# EAGLE design master_jorge2 (EAGLE 7.1.0)
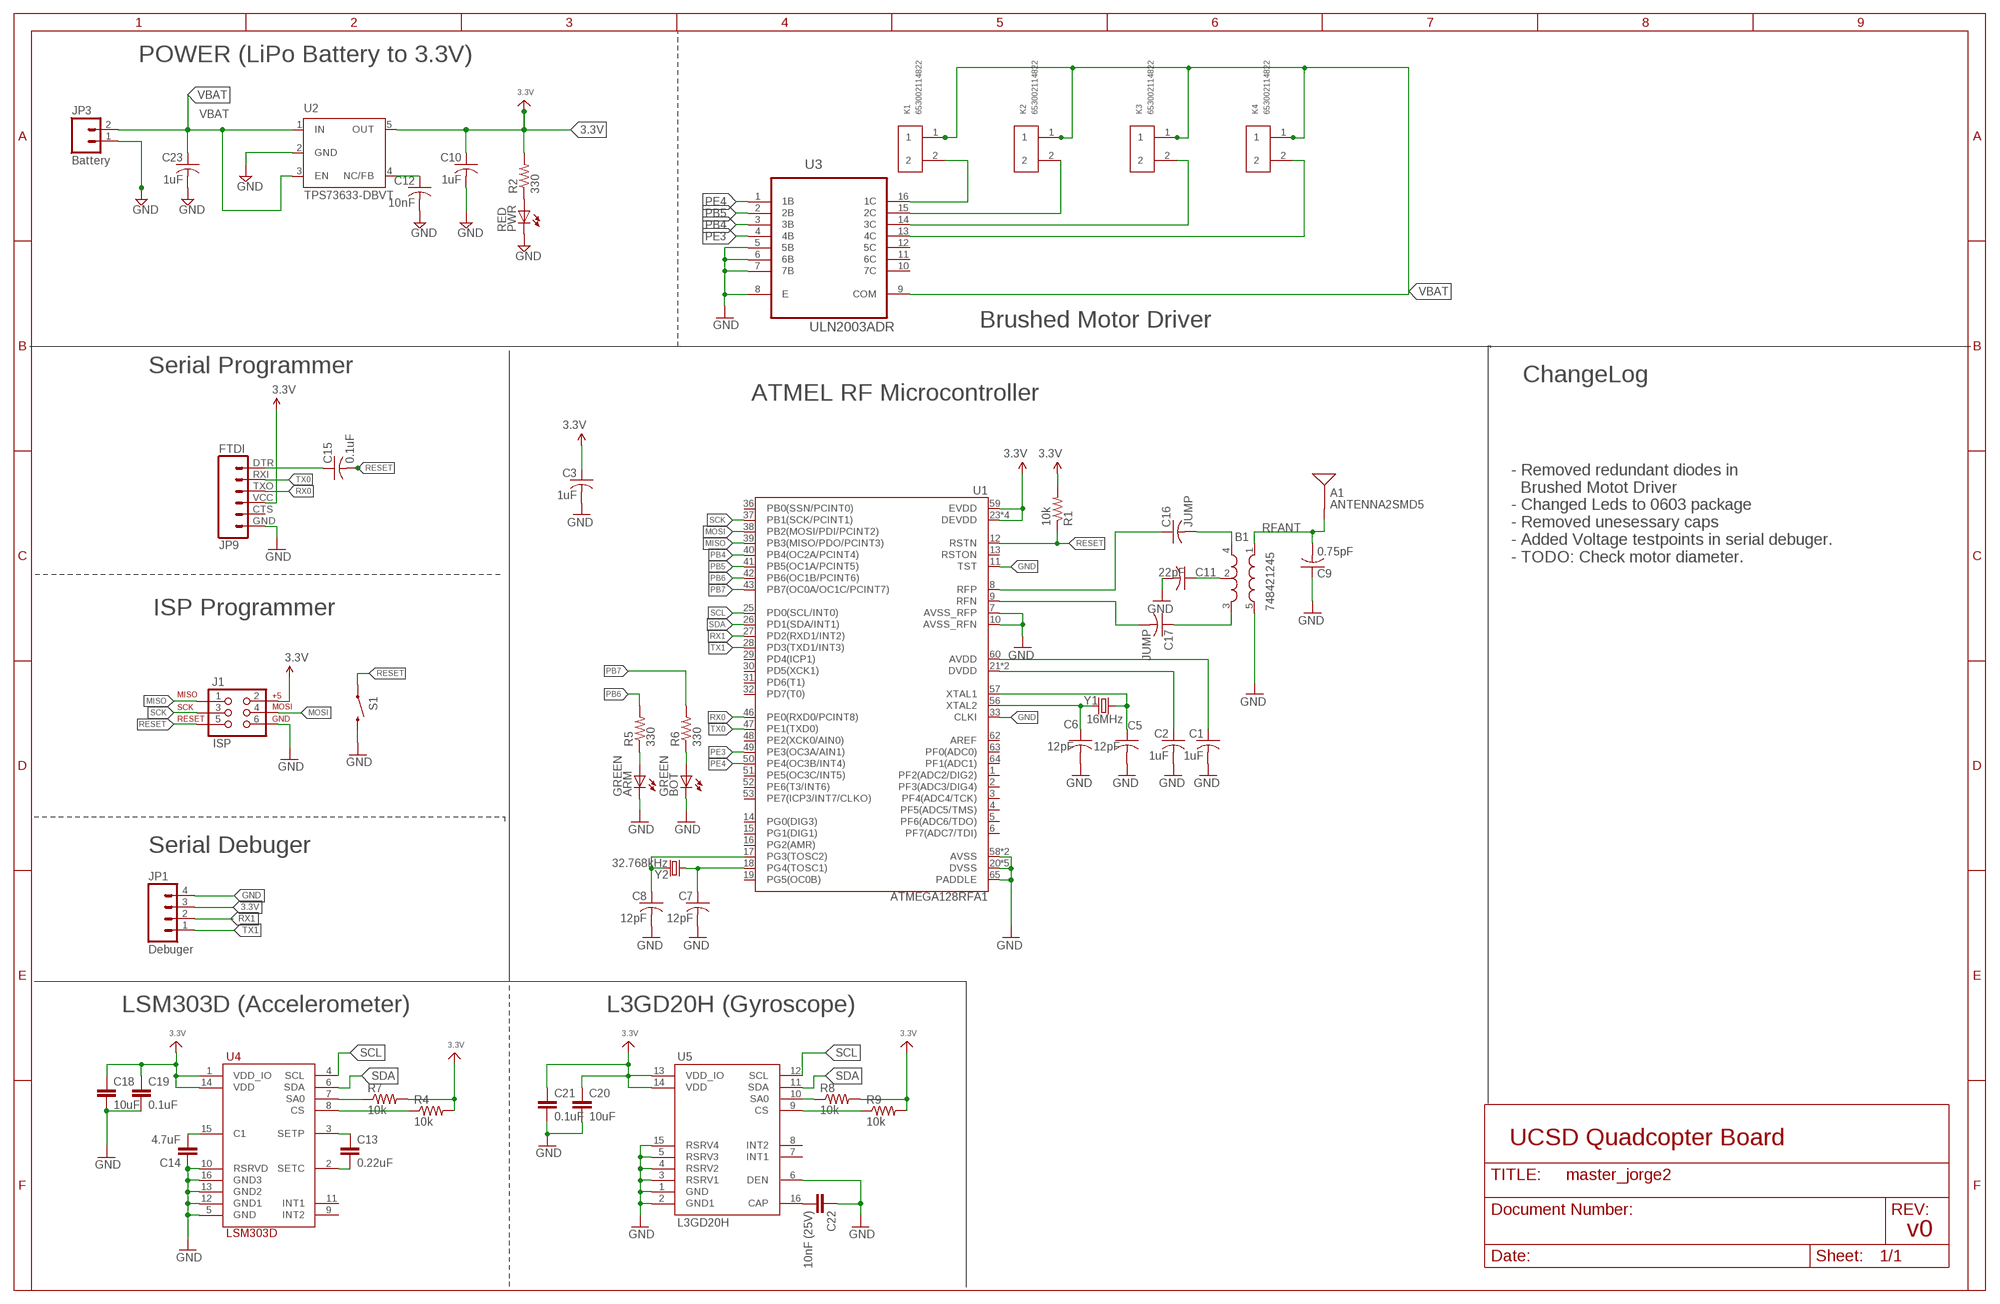
[diagram p0: schematic, sheet 1]

## Parts
A1  ANTENNA2SMD5  [ANTENNA-CHIP5]
ARM  GREEN  LEDCHIPLED_0603  [CHIPLED_0603]
B1  748421245  BALUN0805  [BALUN]
BOT  GREEN  LEDCHIPLED_0603  [CHIPLED_0603]
C1  1uF  C-USC0805  [C0805]
C2  1uF  C-USC0805  [C0805]
C3  1uF  C-USC0805  [C0805]
C5  12pF  C-USC0805  [C0805]
C6  12pF  C-USC0805  [C0805]
C7  12pF  C-USC0805  [C0805]
C8  12pF  C-USC0805  [C0805]
C9  0.75pF  C-USC0805  [C0805]
C10  1uF  C-USC0805  [C0805]
C11  22pF  C-USC0805  [C0805]
C12  10nF  C-USC0805  [C0805]
C13  0.22uF  CAP0805  [0805]
C14  4.7uF  CAP0805  [0805]
C15  0.1uF  C-USC0805  [C0805]
C16  JUMP  C-USC0805  [C0805]
C17  JUMP  C-USC0805  [C0805]
C18  10uF  CAP0805  [0805]
C19  0.1uF  CAP0805  [0805]
C20  10uF  CAP0805  [0805]
C21  0.1uF  CAP0805  [0805]
C22  10nF (25V)  CAP0805  [0805]
C23  1uF  C-USC0805  [C0805]
J1  ISP  AVR_SPI_PRG_6NS  [2X3-NS]
JP1  Debuger  M04PTH  [1X04]
JP3  Battery  M02PTH  [1X02]
JP9  FTDI  FTDI_BASICPTH  [FTDI_BASIC]
K1  653002114822  [653002114822]
K2  653002114822  [653002114822]
K3  653002114822  [653002114822]
K4  653002114822  [653002114822]
PWR  RED  LEDCHIPLED_0603  [CHIPLED_0603]
R1  10k  R-US_R0805  [R0805]
R2  330  R-US_R0805  [R0805]
R4  10k  RESISTOR0805-RES  [0805]
R5  330  R-US_R0805  [R0805]
R6  330  R-US_R0805  [R0805]
R7  10k  RESISTOR0805-RES  [0805]
R8  10k  RESISTOR0805-RES  [0805]
R9  10k  RESISTOR0805-RES  [0805]
S1  SWITCH-MOMENTARY-2SMD  [TACTILE_SWITCH_SMD]
U1  ATMEGA128RFA1  [QFN-64]
U2  TPS73633-DBVT  [SOT23-DBV]
U3  ULN2003ADR  [SOIC127P600X175-16N]
U4  LSM303D  [LGA16_3X3MM]
U5  L3GD20H  [LGA16_3X3MM]
Y1  16MHz  CRYSTAL5X3  [CRYSTAL-SMD-5X3]
Y2  32.768kHz  CRYSTAL32-SMD  [CRYSTAL-32KHZ-SMD]

## Nets
3.3V: C3.1 C10.1 C18.1 C19.1 C20.1 C21.1 J1.2 JP1.3 JP9.VCC R1.2 R2.2 R4.2 R7.2 R8.2 R9.2 U1.23(DEVDD) U1.34(DEVDD) U1.44(DEVDD) U1.54(DEVDD) U1.59(EVDD) U2.5(OUT) U4.1(VDD_IO) U4.14(VDD) U5.13(VDD_IO) U5.14(VDD)
AVDD: C1.1 U1.60(AVDD)
DTR: C15.1 JP9.DTR
DVDD: C2.1 U1.21(DVDD) U1.22(DVDD)
GND: ARM.C B1.5(GND) BOT.C C1.2 C2.2 C3.2 C5.2 C6.2 C7.2 C8.2 C9.1 C10.2 C11.2 C12.2 C14.1 C18.2 C19.2 C20.2 C21.2 C22.1 C23.2 J1.6 JP1.4 JP3.1 JP9.GND PWR.C S1.3 U1.7(AVSS_RFP) U1.10(AVSS_RFN) U1.11(TST) U1.20(DVSS) U1.24(DVSS) U1.33(CLKI) U1.35(DVSS) U1.45(DVSS) U1.55(DVSS) U1.58(AVSS) U1.61(AVSS) U1.65(PADDLE) U2.2(GND) U3.5(5B) U3.6(6B) U3.7(7B) U3.8(E) U4.5(GND) U4.10(RSRVD) U4.12(GND1) U4.13(GND2) U4.16(GND3) U5.1(GND) U5.2(GND1) U5.3(RSRV1) U5.4(RSRV2) U5.5(RSRV3) U5.6(DEN) U5.15(RSRV4)
MISO: J1.1 U1.39(PB3(MISO/PDO/PCINT3))
MOSI: J1.4 U1.38(PB2(MOSI/PDI/PCINT2))
N$1: C12.1 U2.4(NC/FB)
N$2: PWR.A R2.1
N$3: C5.1 U1.57(XTAL1) Y1.3
N$4: C6.1 U1.56(XTAL2) Y1.1
N$5: C7.1 U1.18(PG4(TOSC1)) Y2.X1
N$6: C8.1 U1.17(PG3(TOSC2)) Y2.X2
N$7: B1.2(GND) C11.1
N$8: ARM.A R5.1
N$9: C13.1 U4.3(SETP)
N$10: B1.4(OUT1) C16.2
N$11: B1.3(OUT2) C17.1
N$12: C13.2 U4.2(SETC)
N$13: BOT.A R6.1
N$14: R4.1 U4.8(CS)
N$15: R7.1 U4.7(SA0)
N$16: C14.2 U4.15(C1)
N$17: R8.1 U5.10(SA0)
N$18: R9.1 U5.9(CS)
N$19: C22.2 U5.16(CAP)
N$29: K1.2 U3.16(1C)
N$30: K2.2 U3.15(2C)
N$31: K3.2 U3.14(3C)
N$32: K4.2 U3.13(4C)
PB4: U1.40(PB4(OC2A/PCINT4)) U3.3(3B)
PB5: U1.41(PB5(OC1A/PCINT5)) U3.2(2B)
PB6: R5.2 U1.42(PB6(OC1B/PCINT6))
PB7: R6.2 U1.43(PB7(OC0A/OC1C/PCINT7))
PE3: U1.49(PE3(OC3A/AIN1)) U3.4(4B)
PE4: U1.50(PE4(OC3B/INT4)) U3.1(1B)
RESET: C15.2 J1.5 R1.1 S1.1 U1.12(RSTN)
RFANT [RFSIG]: A1.FEED(SIGNAL) B1.1(IN) C9.2
RFN: C17.2 U1.9(RFN)
RFP: C16.1 U1.8(RFP)
RX0: JP9.TXO U1.46(PE0(RXD0/PCINT8))
RX1: JP1.2 U1.27(PD2(RXD1/INT2))
SCK: J1.3 U1.37(PB1(SCK/PCINT1))
SCL: U1.25(PD0(SCL/INT0)) U4.4(SCL) U5.12(SCL)
SDA: U1.26(PD1(SDA/INT1)) U4.6(SDA) U5.11(SDA)
TX0: JP9.RXI U1.47(PE1(TXD0))
TX1: JP1.1 U1.28(PD3(TXD1/INT3))
VBAT: C23.1 JP3.2 K1.1 K2.1 K3.1 K4.1 U2.1(IN) U2.3(EN) U3.9(COM)
Unconnected: JP9.CTS U1.1(PF2(ADC2/DIG2)) U1.2(PF3(ADC3/DIG4)) U1.3(PF4(ADC4/TCK)) U1.4(PF5(ADC5/TMS)) U1.5(PF6(ADC6/TDO)) U1.6(PF7(ADC7/TDI)) U1.13(RSTON) U1.14(PG0(DIG3)) U1.15(PG1(DIG1)) U1.16(PG2(AMR)) U1.19(PG5(OC0B)) U1.29(PD4(ICP1)) U1.30(PD5(XCK1)) U1.31(PD6(T1)) U1.32(PD7(T0)) U1.36(PB0(SSN/PCINT0)) U1.48(PE2(XCK0/AIN0)) U1.51(PE5(OC3C/INT5)) U1.52(PE6(T3/INT6)) U1.53(PE7(ICP3/INT7/CLKO)) U1.62(AREF) U1.63(PF0(ADC0)) U1.64(PF1(ADC1)) U3.10(7C) U3.11(6C) U3.12(5C) U4.9(INT2) U4.11(INT1) U5.7(INT1) U5.8(INT2)

## Notes on the sheet
- POWER (LiPo Battery to 3.3V)
- Brushed Motor Driver
- Serial Programmer
- ChangeLog
- ATMEL RF Microcontroller
- - Removed redundant diodes in 
    Brushed Motot Driver
  - Changed Leds to 0603 package
  - Removed unesessary caps
  - Added Voltage testpoints in serial debuger.
  - TODO: Check motor diameter.
- ISP Programmer
- Serial Debuger
- LSM303D (Accelerometer) | L3GD20H (Gyroscope)
- UCSD Quadcopter Board
- v0

## Library data of the parts
A1 = SparkFun-RF:ANTENNA2: Chip antenna Single endded antenna. Common with smaller chip antennas. CHIP4 package is the GPS Chip Antenna SKU: GPS-08418. CHIP5 package is 2.4GHz chip antenna SKU: WRL-00144.
ARM BOT PWR = led:LED: LED OSRAM: - CHIPLED LG R971, LG N971, LY N971, LG Q971, LY Q971, LO R971, LY R971 LH N974, LH R974 LS Q976, LO Q976, LY Q976 LO Q996 - Hyper CHIPLED LW Q18S LB Q993, LB Q99A, LB R99A - SideLED LS A670, LO A670, LY A670, LG A670, LP A670 LB A673, LV A673, LT A673, LW A673 LH A674 LY A675 LS A676, LA A676, LO A676, LY A676, LW A676 LS A679, LY A679, LG A679 - Hyper Micro SIDELED® LS Y876, LA Y876, LO Y876, LY Y876 LT Y87S - SmartLED LW L88C, LW L88S LB L89C, LB L89S, LG L890 LS L89K, LO L89K, LY L89K LS L896, LA L896, LO L896, LY L896 - TOPLED LS T670, LO T670, LY T670, LG T670, LP T670 LSG T670, LSP T670, LSY T670, LOP T670, LYG T670 LG T671, LOG T671, LSG T671 LB T673, LV T673, LT T673, LW T673 LH T674 LS T676, LA T676, LO T676, LY T676, LB T676, LH T676, LSB T676, LW T676 LB T67C, LV T67C, LT T67C, LS T67K, LO T67K, LY T67K, LW E67C LS E67B, LA E67B, LO E67B, LY E67B, LB E67C, LV E67C, LT E67C LW T67C LS T679, LY T679, LG T679 LS T770, LO T770, LY T770, LG T770, LP T770 LB T773, LV T773, LT T773, LW T773 LH T774 LS E675, LA E675, LY E675, LS T675 LS T776, LA T776, LO T776, LY T776, LB T776 LHGB T686 LT T68C, LB T68C - Hyper Mini TOPLED® LB M676 - Mini TOPLED Santana® LG M470 LS M47K, LO M47K, LY M47K Source: http://www.osram.convergy.de LUXEON: - LUMILED® LXK2-PW12-R00, LXK2-PW12-S00, LXK2-PW14-U00, LXK2-PW14-V00 LXK2-PM12-R00, LXK2-PM12-S00, LXK2-PM14-U00 LXK2-PE12-Q00, LXK2-PE12-R00, LXK2-PE12-S00, LXK2-PE14-T00, LXK2-PE14-U00 LXK2-PB12-K00, LXK2-PB12-L00, LXK2-PB12-M00, LXK2-PB14-N00, LXK2-PB14-P00, LXK2-PB14-Q00 LXK2-PR12-L00, LXK2-PR12-M00, LXK2-PR14-Q00, LXK2-PR14-R00 LXK2-PD12-Q00, LXK2-PD12-R00, LXK2-PD12-S00 LXK2-PH12-R00, LXK2-PH12-S00 LXK2-PL12-P00, LXK2-PL12-Q00, LXK2-PL12-R00 Source: www.luxeon.com KINGBRIGHT: KA-3528ASYC Source: www.kingbright.com
B1 = SparkFun-RF:BALUN: 0805 footprint balun- Ember 351/357
C1-C3 C5-C12 C15-C17 C23 = resistor:C-US: CAPACITOR, American symbol
C13 C14 C18-C22 = SparkFun-Capacitors:CAP: Capacitor Standard 0603 ceramic capacitor, and 0.1" leaded capacitor.
J1 = SparkFun-Connectors:AVR_SPI_PRG_6: AVR ISP 6 Pin This is the reduced ISP connector for AVR programming. Common on Arduino. This footprint will take up less PCB space and can be used with a 10-pin to 6-pin adapter such as SKU: BOB-08508
JP1 = SparkFun-Connectors:M04: Header 4 Standard 4-pin 0.1" header. Use with straight break away headers (SKU : PRT-00116), right angle break away headers (PRT-00553), swiss pins (PRT-00743), machine pins (PRT-00117), and female headers (PRT-00115). Molex polarized connector foot print use with SKU : PRT-08231 with associated crimp pins and housings. 1MM SMD Version SKU: PRT-10208
JP3 = SparkFun:M02: Header 2 Standard 2-pin 0.1" header. Use with straight break away headers (SKU : PRT-00116), right angle break away headers (PRT-00553), swiss pins (PRT-00743), machine pins (PRT-00117), and female headers (PRT-00115). Molex polarized connector foot print use with SKU : PRT-08233 with associated crimp pins and housings.
JP9 = SparkFun-Connectors:FTDI_BASIC: FTDI Basic header with labels
K1-K4 = Wuerth_Elektronik_eiCan_Wire_to_Board_Connectors:653002114822: WR-WTB 1.25mm Male Vertical Shrouded Header, 2 Pins=>Code : Con_WTB_1.25_PCB_THT_653002114822 <http://katalog.we-online.de/media/thumbs2/eican/thb_Con_WTB_1.25_PCB_THT_6530xx114822_pf2.jpg> Details see: http://katalog.we-online.de/en/em/653_0xx_114_822 Created 2014-06-06, Karrer Zheng 2014 (C) Würth Elektronik; OC_FARNELL: unknown
R1 R2 R5 R6 = resistor:R-US_: RESISTOR, American symbol
R4 R7-R9 = SparkFun-Passives:RESISTOR: Resistor Basic schematic elements and footprints for 0603, 1206, and PTH resistors.
S1 = SparkFun-Electromechanical:SWITCH-MOMENTARY-2: Various NO switches- pushbuttons, reed, etc
U1 = SparkFun-DigitalIC:ATMEGA128RFA1: ATmega128RFA1 8-bit AVR Microcontroller with Low Power 2.4GHz Transceiver for ZigBee and IEEE 802.15.4
U2 = Power:TPS73633-DBVT
U3 = Texas Instruments_By_element14_Batch_1:ULN2003ADR: 8-BIT SHIFT REGISTERS WITH 3-STATE OUTPUT REGISTERS; MPN: ULN2003ADR; OC_FARNELL: 1470513; OC_NEWARK: 77C3560; PACKAGE: SOIC-16; SUPPLIER: TEXAS INSTRUMENTS
U4 = IMU_parts:LSM303D
U5 = IMU_parts:L3GD20H
Y1 Y2 = SparkFun-FreqCtrl:CRYSTAL: Various standard crystals. Proven footprints. Spark Fun Electronics SKU : COM-00534

## Net classes
1 RFSIG: width 0.457 mm, clearance 0.205 mm to class 0, clearance 0.205 mm

## Board
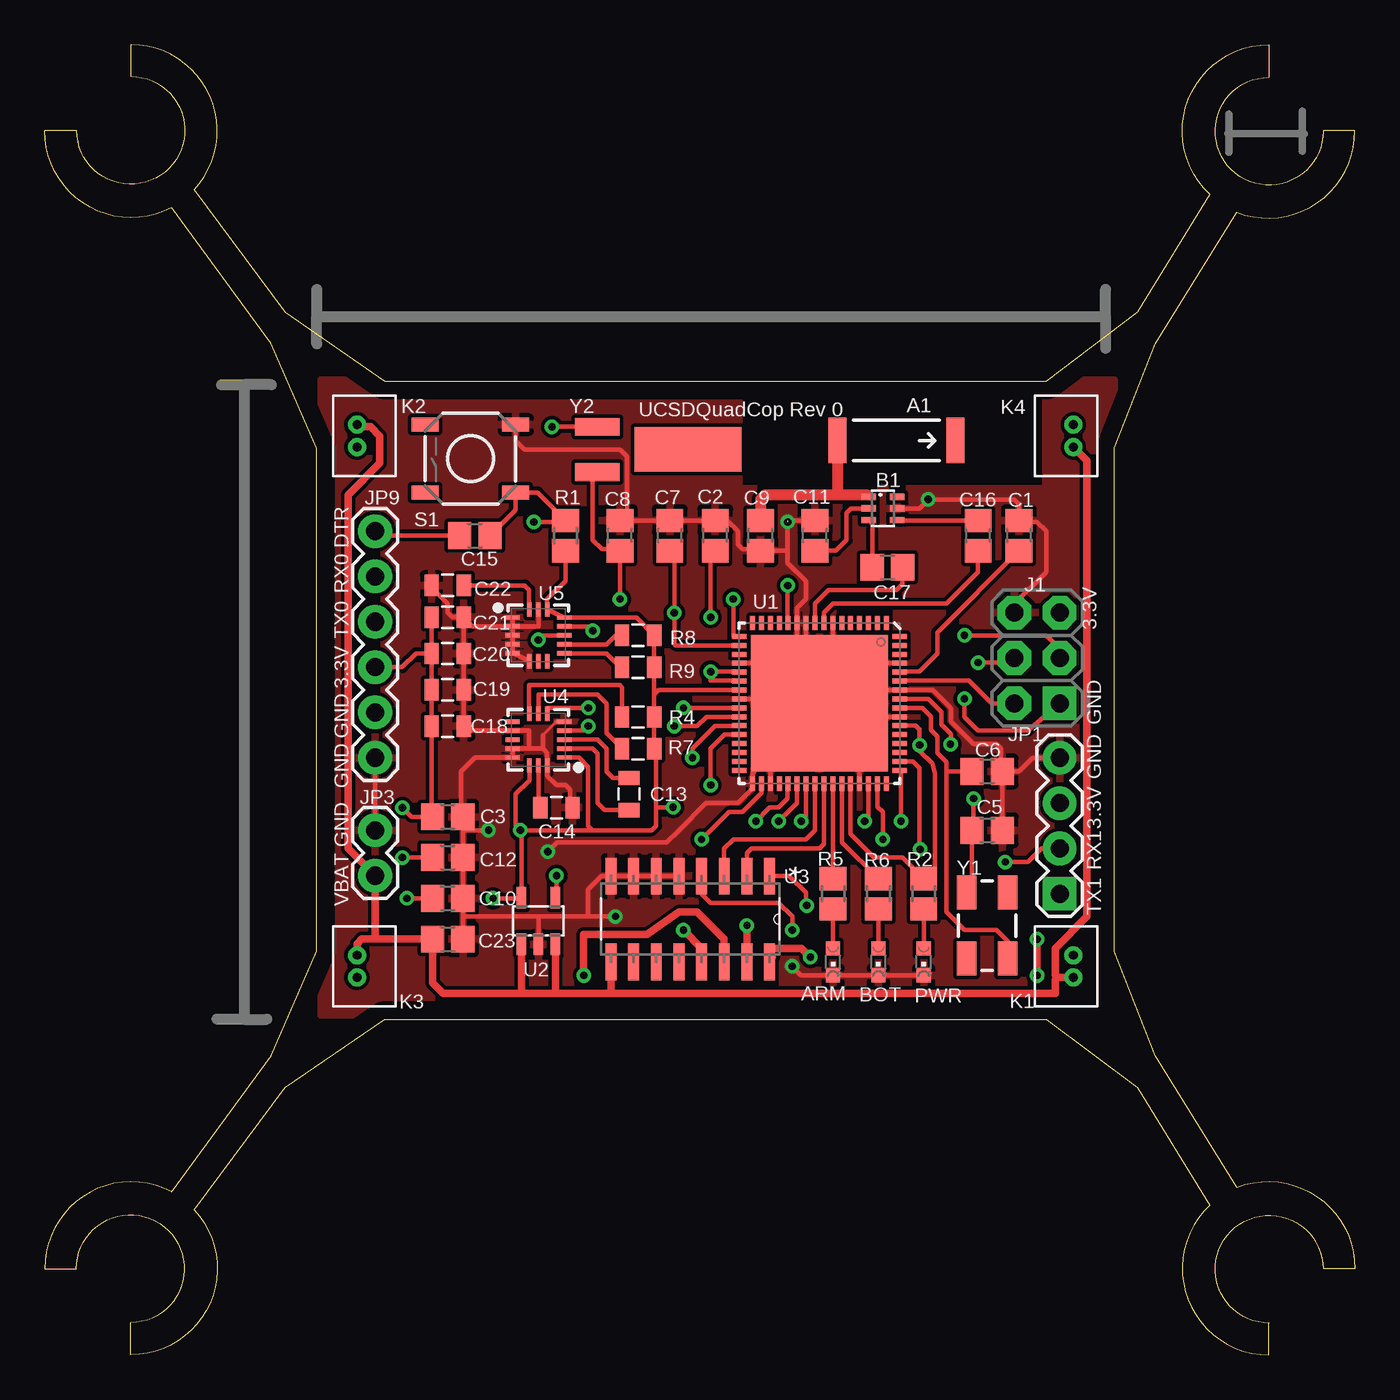
[diagram p1: board, top side]
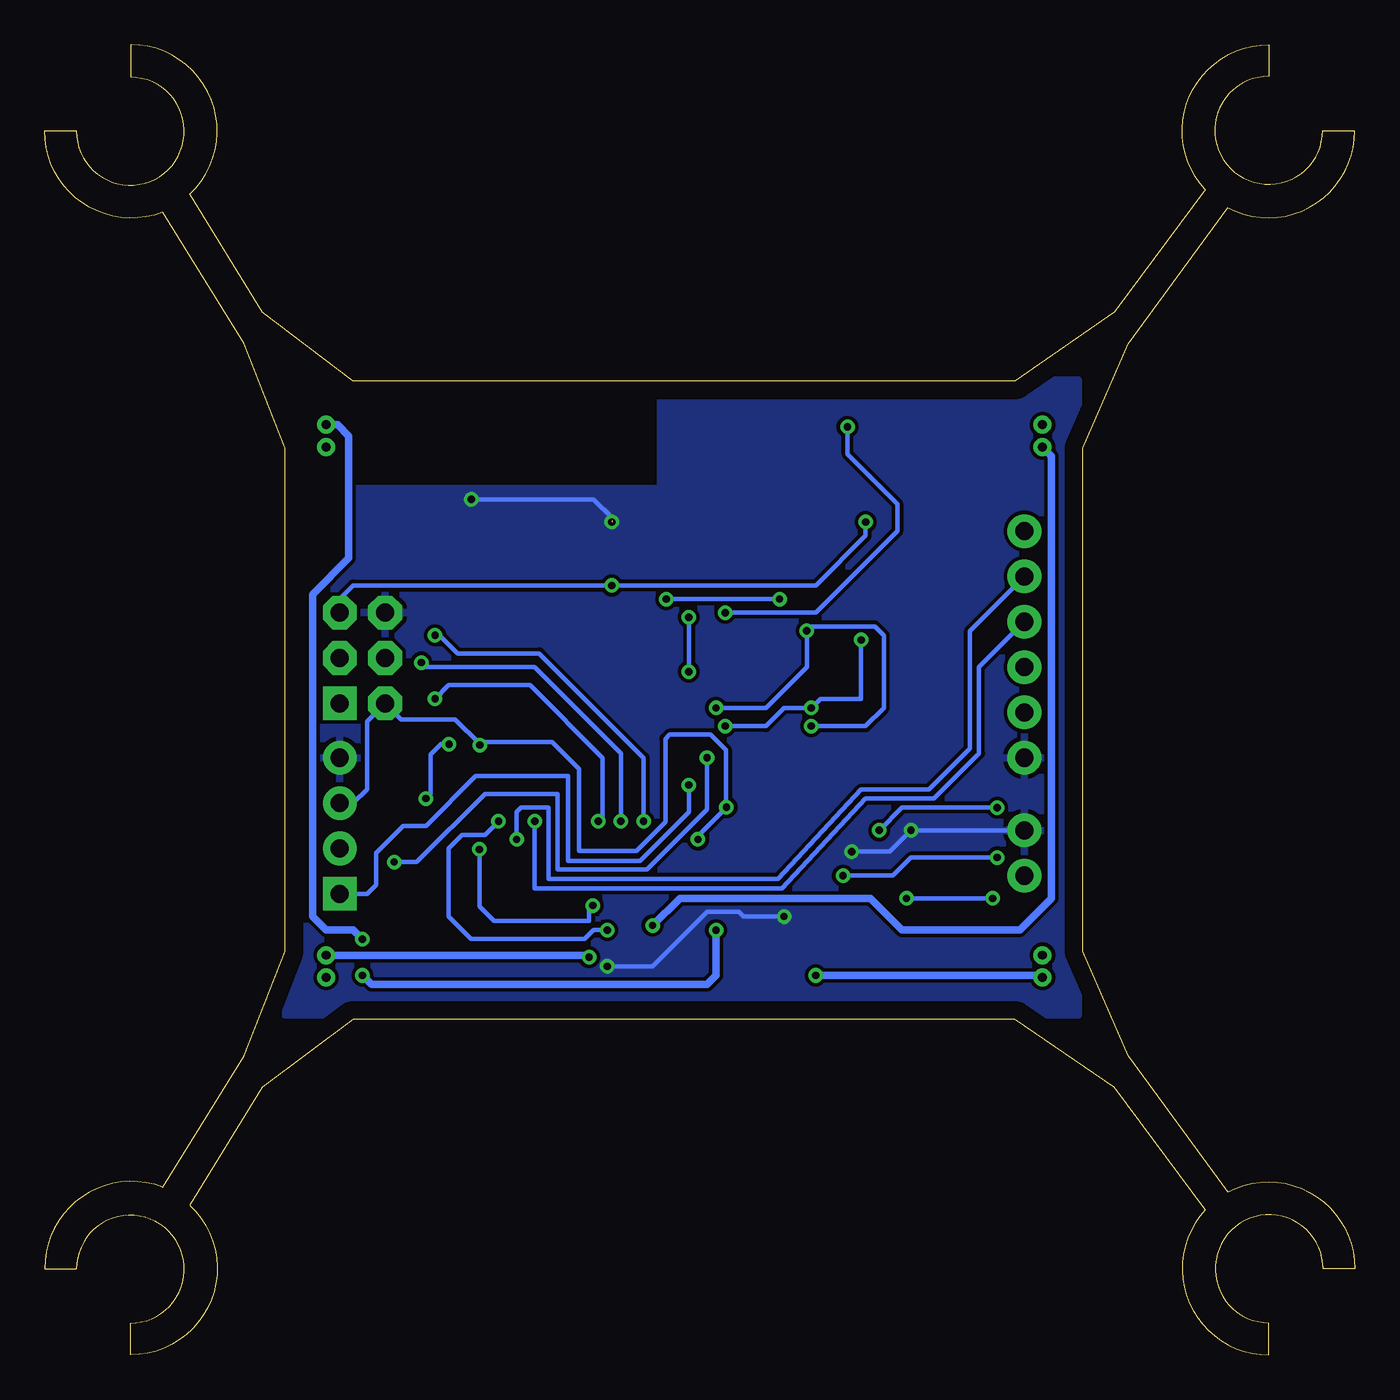
[diagram p2: board, bottom side, seen from below]

Size 73.41 x 73.41 mm. Coordinates in mm from the lower left corner, seen from the top.
Outline: 68.58,1.78 68.58,0 arc-137 65.28,8.38 61.21,14.99 56.13,18.8 19.05,18.8 13.46,14.99 8.38,8.13 arc-133 4.83,0 4.83,1.8 arc270 1.78,4.83 0,4.83 arc-118 7.11,9.14 12.7,16.76 15.24,22.61 15.24,50.8 12.7,56.64 7.11,64.26 arc-118 0,68.58 1.8,68.58 arc270 4.83,71.63 4.83,73.41 arc-133 8.38,65.28 13.46,58.42 19.05,54.55 56.13,54.55 61.21,58.42 65.28,65.02 arc-137 68.58,73.41 68.58,71.58 arc270 71.63,68.56 71.63,68.58 73.41,68.58 arc-111 66.8,64.01 62.23,56.64 59.94,50.8 59.94,22.61 62.23,16.76 66.8,9.4 arc-111 73.41,4.83 71.63,4.83 arc270 68.61,1.78
Copper layers (1*16): Top 0.035mm / dielectric 1.5mm / Bottom 0.035mm
Design rules "default *": minimum track width 1mil, minimum drill 0.003mm, track to track 8mil, track to pad 8mil, pad to pad 8mil, via to via 8mil, smd to smd 8mil, copper to edge 40mil, drill to drill 8mil, minimum pad ring 10mil, minimum via ring 8mil, stop-mask expansion 4mil, vias tented up to drill 0mil, thermal gap 10mil
tRestrict: area 43.7,52.6 to 45.2,54.1; area 50.3,52.6 to 51.6,54.1; area 50.3,48.8 to 51.6,49.8; area 39.1,48.8 to 43.7,54.1; area 45.2,48.8 to 50.3,54.1; area 43.7,52.6 to 45.2,54.1; area 51.6,48.8 to 55.9,54.1
bRestrict: area 51.6,48.8 to 55.9,54.1; area 39.1,48.8 to 43.7,54.1; area 45.2,48.8 to 50.3,54.1; area 43.7,48.8 to 45.2,52.6; area 50.3,52.6 to 51.6,54.1; area 50.3,48.8 to 51.6,49.8

### Footprints (pad centres in the part's own frame; a part is rotated, then mirrored left to right if it is on the bottom)
ANTENNA-CHIP5 = smd 1.016 x 2.54: FEED -3.302,0; NC 3.302,0
CHIPLED_0603 = smd 0.8 x 0.8: A 0,-0.75; C 0,0.75
BALUN = smd 0.35 x 0.8: 1 -0.65,-0.8; 2 0,-0.8; 3 0.65,-0.8; 4 0.65,0.8; 5 0,0.8; 6 -0.65,0.8
C0805 = smd 1.3 x 1.5: 1 -0.85,0; 2 0.85,0
0805 = smd 0.8 x 1.2: 1 -0.9,0; 2 0.9,0
2X3-NS = drill 1.016 pad 1.88 square: 1 -2.54,-1.27 | drill 1.016 pad 1.88 octagon: 2 -2.54,1.27; 3 0,-1.27; 4 0,1.27; 5 2.54,-1.27; 6 2.54,1.27
1X04 = drill 1.016 pad 1.88 square: 1 0,0 | drill 1.016 pad 1.88: 2 2.54,0; 3 5.08,0; 4 7.62,0
1X02 = drill 1.016 pad 1.88: 1 0,0; 2 2.54,0
FTDI_BASIC = drill 1.016 pad 1.88: CTS 10.16,0; DTR 0,0; GND 12.7,0; RXI 2.54,0; TXO 5.08,0; VCC 7.62,0
653002114822 = drill 0.5: 1 0.625,0; 2 -0.625,0
R0805 = smd 1.3 x 1.5: 1 -0.85,0; 2 0.85,0
TACTILE_SWITCH_SMD = smd 1.524 x 0.762: 1 -2.54,1.905; 2 2.54,1.905; 3 -2.54,-1.905; 4 2.54,-1.905
QFN-64 = smd 0.8 x 0.28: 1 -4.5,3.75; 2 -4.5,3.25; 3 -4.5,2.75; 4 -4.5,2.25; 5 -4.5,1.75; 6 -4.5,1.25; 7 -4.5,0.75; 8 -4.5,0.25; 9 -4.5,-0.25; 10 -4.5,-0.75; 11 -4.5,-1.25; 12 -4.5,-1.75; 13 -4.5,-2.25; 14 -4.5,-2.75; 15 -4.5,-3.25; 16 -4.5,-3.75; 33 4.5,-3.75; 34 4.5,-3.25; 35 4.5,-2.75; 36 4.5,-2.25; 37 4.5,-1.75; 38 4.5,-1.25; 39 4.5,-0.75; 40 4.5,-0.25; 41 4.5,0.25; 42 4.5,0.75; 43 4.5,1.25; 44 4.5,1.75; 45 4.5,2.25; 46 4.5,2.75; 47 4.5,3.25; 48 4.5,3.75 | smd 0.28 x 0.8: 17 -3.75,-4.5; 18 -3.25,-4.5; 19 -2.75,-4.5; 20 -2.25,-4.5; 21 -1.75,-4.5; 22 -1.25,-4.5; 23 -0.75,-4.5; 24 -0.25,-4.5; 25 0.25,-4.5; 26 0.75,-4.5; 27 1.25,-4.5; 28 1.75,-4.5; 29 2.25,-4.5; 30 2.75,-4.5; 31 3.25,-4.5; 32 3.75,-4.5; 49 3.75,4.5; 50 3.25,4.5; 51 2.75,4.5; 52 2.25,4.5; 53 1.75,4.5; 54 1.25,4.5; 55 0.75,4.5; 56 0.25,4.5; 57 -0.25,4.5; 58 -0.75,4.5; 59 -1.25,4.5; 60 -1.75,4.5; 61 -2.25,4.5; 62 -2.75,4.5; 63 -3.25,4.5; 64 -3.75,4.5 | smd 7.65 x 7.65: 65 0,0
SOT23-DBV = smd 0.55 x 1.2: 1 -0.95,-1.3; 2 0,-1.3; 3 0.95,-1.3; 4 0.95,1.3; 5 -0.95,1.3
SOIC127P600X175-16N = smd 2.057 x 0.61: 1 -4.801,8.89; 2 -4.801,7.62; 3 -4.801,6.35; 4 -4.801,5.08; 5 -4.801,3.81; 6 -4.801,2.54; 7 -4.801,1.27; 8 -4.801,0; 9 0,0; 10 0,1.27; 11 0,2.54; 12 0,3.81; 13 0,5.08; 14 0,6.35; 15 0,7.62; 16 0,8.89
LGA16_3X3MM = smd 0.8 x 0.25: 1 -1.45,1; 2 -1.45,0.5; 3 -1.45,0; 4 -1.45,-0.5; 5 -1.45,-1; 9 1.45,-1; 10 1.45,-0.5; 11 1.45,0; 12 1.45,0.5; 13 1.45,1 | smd 0.25 x 0.8: 6 -0.5,-1.45; 7 0,-1.45; 8 0.5,-1.45; 14 0.5,1.45; 15 0,1.45; 16 -0.5,1.45
CRYSTAL-SMD-5X3 = smd 1.9 x 1.1: 1 -1.85,-1.15; 2 1.85,-1.15; 3 1.85,1.15; 4 -1.85,1.15
CRYSTAL-32KHZ-SMD = smd 2.5 x 6: SHEILD 0,5.08 | smd 1 x 2.5: X1 -1.27,0; X2 1.27,0

### Placement (x,y rotation side)
A1  47.73,51.23 0 top
ARM  44.17,22.02 180 top
B1  46.96,47.42 270 top
BOT  46.71,22.02 180 top
C1  54.58,45.9 90 top
C2  37.57,45.9 90 top
C3  22.58,30.15 0 top
C5  52.81,29.39 0 top
C6  52.81,32.69 0 top
C7  35.03,45.9 90 top
C8  32.23,45.9 90 top
C9  40.11,45.9 90 top
C10  22.58,25.58 0 top
C11  43.15,45.9 90 top
C12  22.58,27.86 0 top
C13  32.74,31.42 270 top
C14  28.68,30.66 180 top
C15  24.1,45.9 0 top
C16  52.3,45.9 90 top
C17  47.22,44.12 0 top
C18  22.58,35.23 0 top
C19  22.58,37.26 0 top
C20  22.58,39.29 0 top
C21  22.58,41.33 0 top
C22  22.58,43.1 0 top
C23  22.58,23.29 0 top
J1  55.6,39.04 90 top
JP1  56.87,25.83 90 top
JP3  18.52,29.39 270 top
JP9  18.52,46.15 270 top
K1  57.63,21.77 270 top
K2  17.5,51.49 90 top
K3  17.5,21.77 90 top
K4  57.63,51.49 270 top
PWR  49.25,22.02 180 top
R1  29.18,45.9 270 top
R2  49.25,25.83 90 top
R4  33.25,35.74 0 top
R5  44.17,25.83 90 top
R6  46.71,25.83 90 top
R7  33.25,33.96 0 top
R8  33.25,40.31 0 top
R9  33.25,38.53 0 top
S1  23.85,50.22 180 top
U1  43.41,36.5 270 top
U2  27.66,24.31 0 top
U3  31.72,22.02 270 top
U4  27.66,34.47 180 top
U5  27.66,40.31 0 top
Y1  52.81,24.05 90 top
Y2  30.96,50.72 270 top

### Tracks (layer width: path | path; a pad name or v marks a point on that pad's centre or on a via)
3.3V  (via drill 0.41)
  Top 0.254: 34.15,37.01 R9.2 R8.2 33.15,41.31 U5.13 U5.14 28.16,42.33 29.19,43.36 R1.2 | 34.15,37.01 R4.2 R7.2 34.27,33.84 34.27,30.7 | J1.2 53.06,36.5 51.79,37.77 47.93,37.77 U1.59 | 34.27,30.7 34.27,29.64 34.01,29.39 30.71,29.39 | U1.23 34.39,37.25 34.15,37.01 | C21.1 C20.1 | C20.1 C19.1 C18.1 21.68,30.2 C3.1 20.55,30.15 v20.04,30.66 | U4.14 27.16,32.19 26.39,31.42 26.39,29.64 v26.64,29.39 | v26.64,29.39 30.71,29.39 | U4.1 29.93,33.47 30.45,32.94 30.45,29.64 30.71,29.39 | C20.1 20.8,39.29 20.04,38.53 JP9.VCC | v26.64,29.39 26.71,29.32 U2.5 26.68,25.58 v25.12,25.58 | C10.1 v20.3,25.58 | U1.54 48.77,35.25 48.97,35.05 49.02,35.05 v49.02,34.16 49.02,33.83 49.73,33.12 49.89,32.56 49.89,27.19 R2.2 48.07,27.86 46.46,27.86 45.14,29.18 45.14,31.98 | U1.34 40.16,31.47 39.09,30.4 38.33,30.4 v36.8,28.88 | 45.14,32 U1.44 45.14,31.98 | 45.14,32.11 45.14,31.98 | v35.21,30.68 34.28,30.68 34.27,30.7
  Bottom 0.254: v20.04,30.66 25.38,30.66 v26.64,29.39 | v20.3,25.58 v25.12,25.58 | JP1.3 56.11,30.91 55.35,31.67 55.35,35.48 J1.2 53.44,35.61 50.42,35.61 49.02,34.21 v49.02,34.16 48.84,34.34 44.98,34.34 43.46,32.82 43.46,28.22 40.26,28.22 38.63,29.84 38.63,34.52 38.41,34.75 36.09,34.75 35.24,33.9 35.24,30.71 v35.21,30.68 36.8,29.09 v36.8,28.88
AVDD
  Top 0.254: U1.60 47.94,38.28 49,38.28 50.01,39.29 50.01,40.48 C1.1
DTR
  Top 0.254: C15.1 18.77,45.9 JP9.DTR
DVDD  (via drill 0.41)
  Top 0.254: C2.1 37.31,45.05 v37.31,41.33 | U1.22 38.91,37.77 37.31,37.77 v37.31,38.28 38.91,38.28 U1.21
  Bottom 0.254: v37.31,41.33 v37.31,38.28
GND  (via drill 0.41)  (1 unrouted)
  Top 0.178: 27.91,34.72 28.68,35.48
  Top 0.241: 28.68,35.48 29.09,35.48 U4.5
  Top 0.254: C23.2 23.43,24.56 | 23.43,24.56 C10.2 C12.2 23.43,29.39 | 23.43,29.39 C3.2 23.34,30.24 23.34,32.69 24.12,33.47 U4.13 U4.12 | 27.66,24.56 23.43,24.56 | C6.2 C5.2 | U3.5 U3.6 U3.7 U3.8 31.19,26.82 30.45,26.09 30.45,24.56 | 32.77,46.75 C7.2 C2.2 38.24,46.75 38.84,46.15 38.84,45.39 39.09,45.14 40.02,45.14 C9.1 41.63,45.05 | 32.77,46.75 C8.2 | 26.39,52.25 S1.3 26.39,51.23 26.9,50.72 32.23,50.72 32.64,50.32 32.64,46.88 32.77,46.75 | U5.2 26.2,40.82 23.99,40.82 C21.2 | 27.91,33.96 28.16,33.71 U4.16 28.16,32.44 28.68,31.93 29.19,31.93 29.44,31.67 29.44,30.8 C14.1 | 27.91,33.96 27.15,33.96 | 27.15,33.96 U4.12 | U4.12 | U4.5 28.66,35.47 | 27.91,34.72 27.91,33.96 | U5.1 U5.2 | U5.2 U5.3 U5.4 U5.5 U5.6 | 27.15,33.96 27.15,34.98 27.14,34.97 U4.10 23.74,34.97 C18.2 C19.2 C20.2 C21.2 | JP9.GND JP3.1 | U5.15 27.66,40.82 26.21,40.82 U5.2 | C22.1 21.68,42.99 22.58,42.09 22.58,41.58 22.84,41.33 C21.2 | v24.87,29.39 23.43,29.39 | JP1.4 55.35,33.45 54.59,32.69 C6.2 | U1.10 42.66,37.25 | 42.66,37.25 U1.65 | 42.66,37.25 42.16,36.75 40.82,36.75 | U1.7 44.16,38.75 | 44.16,38.75 42.66,37.25 | 44.16,38.75 U1.61 | U1.10 42.66,39.56 42.14,39.04 42.14,40.98 U1.11 42.16,41.85 42.65,42.34 42.65,43.36 41.63,44.37 41.63,45.05 | U1.10 42.66,39.03 43.16,38.53 40.87,38.53 40.62,38.79 40.58,38.75 U1.20 | U1.10 42.66,40.04 45.44,37.26 | 45.44,37.26 47.91,37.26 | U1.10 42.66,36.51 | 41.63,45.05 41.63,46.75 C11.2 | B1.5 49,47.42 v49.51,47.93 54.33,47.93 54.59,47.68 C1.2 54.67,46.66 55.6,46.66 56.11,46.15 56.11,43.87 54.33,42.09 J1.6 | 47.92,37.26 U1.58 47.91,37.26 | 49.25,21.26 PWR.C BOT.C ARM.C 42.38,21.27 v41.88,21.77 | v31.98,24.56 30.45,24.56
  Top 0.254: C6.2 53.57,32.78 53.57,33.96 53.32,34.21 52.05,34.21 50.77,35.48 50.77,36.25 49.76,37.26 47.91,37.26 | U2.2 27.66,24.56 | 27.66,24.56 30.45,24.56 | U1.24 40.82,36.75 | 40.67,33.73 39.66,32.57 U1.33 39.66,31.73 38.84,30.91 37.06,30.91 35.54,29.39 35.53,29.39 34.84,28.7 28.7,28.7 v28.19,28.19 | 40.67,33.73 40.87,33.96 40.87,36.7 40.82,36.75 | U1.45 45.66,35.75 | 45.66,35.75 45.66,37.04 45.44,37.26 | U1.55 45.66,35.75 | U1.35 40.67,33.73
  Bottom 0.254: JP3.1 v24.87,29.39 26.06,28.19 v28.19,28.19 | v41.63,46.66 41.63,46.91 42.65,47.93 v49.51,47.93 | v31.98,24.56 34.27,24.56 34.52,24.82 36.3,24.82 39.34,21.77 v41.88,21.77
  pour Top: 15.49,54.61 15.49,19.05 59.94,19.05 59.94,54.61
  pour Bottom: 15.49,54.61 15.49,19.05 59.94,19.05 59.94,54.61
MISO  (via drill 0.41)
  Top 0.254: v42.39,29.9 42.65,30.15 42.65,31.99 U1.39 | J1.1 55.09,34.98 52.3,34.98 51.54,35.74 v51.54,36.75
  Bottom 0.254: v42.39,29.9 42.14,30.15 42.14,33.45 46.2,37.52 50.77,37.52 v51.54,36.75
MOSI  (via drill 0.41)
  Top 0.254: U1.38 42.16,30.93 v41.12,29.9 | v52.3,38.79 54.08,38.79 J1.4
  Bottom 0.254: v41.12,29.9 41.12,33.71 45.95,38.53 52.05,38.53 v52.3,38.79
N$1  (via drill 0.41)
  Top 0.254: C12.1 v20.04,27.86 | v28.68,26.85 28.68,25.67 U2.4
  Bottom 0.254: v20.04,27.86 24.87,27.86 25.88,26.85 v28.68,26.85
N$2
  Top 0.254: R2.1 PWR.A
N$3  (via drill 0.41)
  Top 0.254: Y1.3 51.96,26.2 C5.1 52.05,29.48 v52.05,31.17 | U1.57 49.51,36.75 50.24,36.02 50.24,35.31 50.77,34.77 50.77,34.24 v50.75,34.21
  Bottom 0.254: v52.05,31.17 51.79,31.42 51.79,33.63 51.21,34.21 v50.75,34.21
N$4
  Top 0.254: Y1.1 53.96,23.16 53.32,23.8 51.54,23.8 50.52,24.82 50.52,32.69 | 50.52,32.69 50.52,33.22 50.01,33.73 50.01,34.65 49.66,35 49.66,35.76 49.17,36.25 U1.56 | C6.1 50.52,32.69
N$5  (via drill 0.41)
  Top 0.254: Y2.X1 31.22,51.99 | Y2.X1 30.2,51.99 | C7.1 35.28,44.79 v35.28,41.58 35.28,39.8 35.31,39.8 35.36,39.75 U1.18 | v28.42,51.99 Y2.X1
  Bottom 0.254: v35.28,41.58 30.2,41.58 25.63,46.15 25.63,47.68 28.42,50.47 v28.42,51.99
N$6  (via drill 0.41)
  Top 0.254: Y2.X2 30.71,49.45 30.71,45.64 31.22,45.14 32.15,45.14 C8.1 v32.23,42.34 | U1.17 38.58,40.25 v38.58,42.34
  Bottom 0.254: v38.58,42.34 v32.23,42.34
N$7
  Top 0.254: C11.1 44.34,45.05 44.93,45.64 44.93,47.17 45.19,47.42 B1.2
N$8
  Top 0.254: R5.1 ARM.A
N$9
  Top 0.254: C13.1 31.84,32.32 31.47,32.69 31.47,33.96 30.96,34.47 U4.3
N$10
  Top 0.254: C16.2 47.79,46.75 B1.4
N$11
  Top 0.254: C17.1 46.37,46.57 B1.3
N$12
  Top 0.254: C13.2 31.35,30.52 30.96,30.91 30.96,33.71 30.7,33.97 U4.2
N$13
  Top 0.254: R6.1 BOT.A
N$14
  Top 0.254: R4.1 32.35,37.4 32.23,37.52 27.15,37.52 U4.8
N$15
  Top 0.254: U4.7 27.66,37.01 30.96,37.01 31.47,36.5 31.47,34.84 R7.1
N$16
  Top 0.254: C14.2 27.78,31.05 27.66,31.17 U4.15
N$17
  Top 0.254: R8.1 31.98,40.31 31.47,39.8 U5.10
N$18
  Top 0.254: R9.1 32.23,38.53 31.47,39.29 29.13,39.29 U5.9
N$19
  Top 0.254: C22.2 26.9,43.1 27.15,42.85 27.15,41.77 U5.16
N$29  (via drill 0.41)
  Top 0.254: 40.87,22.28 U3.16
  Top 0.406: U3.16 40.62,22.78 42.39,22.78 v42.9,22.28
  Bottom 0.254: 42.76,22.39 v42.9,22.28
  Bottom 0.406: K1.2 42.76,22.39
N$30  (via drill 0.41)
  Top 0.406: U3.15 v39.34,24.05
  Bottom 0.406: v39.34,24.05 37.82,25.58 27.15,25.58 25.38,23.8 18.77,23.8 16.99,25.58 16.99,50.35 K2.2
N$31  (via drill 0.41)
  Top 0.406: U3.14 38.08,23.29 36.55,24.82 35.54,24.82 33.76,23.55 30.2,23.55 v30.2,21.26
  Bottom 0.406: v30.2,21.26 17.62,21.26 K3.2
N$32  (via drill 0.41)
  Top 0.254: U3.13 36.8,22.78
  Top 0.406: 36.8,22.78 v35.79,23.8 | v55.6,23.29 v55.6,21.26
  Bottom 0.406: v35.79,23.8 35.79,21.26 36.3,20.75 55.09,20.75 v55.6,21.26 | K4.2 56.99,52.11 56.36,51.49 56.36,44.63 58.4,42.6 58.4,24.56 57.63,23.8 56.11,23.8 v55.6,23.29
PB4
  Top 0.254: U3.3 38.08,28.37 38.58,28.88 42.65,28.88 43.16,29.39 U1.40
PB5
  Top 0.254: U3.2 39.34,28.12 39.6,28.37 43.41,28.37 43.66,28.63 U1.41
PB6
  Top 0.254: R5.2 44.17,31.99 U1.42
PB7
  Top 0.254: U1.43 44.68,31.98 44.68,28.71 R6.2
PE3  (via drill 0.41)
  Top 0.254: v47.98,29.9 47.98,32.68 U1.49 | U3.4 36.8,25.83 37.31,25.32 41.12,25.32 41.88,24.56 v41.88,23.8
  Bottom 0.254: v47.98,29.9 48.74,29.13 50.01,29.13 50.77,28.37 50.77,24.56 49.51,23.29 43.16,23.29 42.65,23.8 v41.88,23.8
PE4  (via drill 0.41)
  Top 0.254: U1.50 48.64,33.25 49.02,32.87 49.02,28.35 v49.05,28.32 | U3.1 41.71,26.82 42.64,25.9 42.64,25.23 v42.69,25.18
  Bottom 0.254: v49.05,28.32 49.05,25.12 48.23,24.31 42.9,24.31 42.9,24.97 v42.69,25.18
RESET  (via drill 0.41)
  Top 0.254: C15.2 26.39,47.33 S1.1 27.62,48.31 R1.1 29.1,46.66 v27.41,46.66 | v41.63,43.1 41.63,41.03 U1.12
  Bottom 0.254: J1.5 56.87,42.34 56.11,43.1 v41.63,43.1 30.2,43.1 27.41,45.9 v27.41,46.66
RFANT
  Top 0.254: 46.05,48.18 46.16,48.18 B1.1
  Top 0.61: 44.42,48.18 40.36,48.18 40.11,47.93 C9.2 | A1.FEED 44.42,48.18 | 46.05,48.18 44.42,48.18
RFN
  Top 0.254: C17.2 48.07,43.19 47.73,42.85 43.92,42.85 43.16,42.09 U1.9
RFP
  Top 0.254: U1.8 43.66,41.58 44.17,42.09 50.52,42.09 52.3,43.87 C16.1
RX0  (via drill 0.41)
  Top 0.254: U1.46 46.16,30.11 v45.95,29.9
  Bottom 0.254: JP9.TXO 21.06,38.53 21.06,33.71 23.6,31.17 27.41,31.17 32.11,26.14 45.95,26.14 v45.95,29.9
RX1  (via drill 0.41)
  Top 0.254: v53.82,27.61 55.09,27.61 55.86,28.37 JP1.2 | U1.27 38.89,35.23 37.57,35.23 36.3,33.96 v36.3,33.45
  Bottom 0.254: v53.82,27.61 52.55,27.61 48.74,31.42 44.68,31.42 44.68,27.2 39.65,27.2 36.3,30.56 v36.3,33.45
SCK  (via drill 0.41)
  Top 0.254: J1.3 56.87,39.55 56.11,40.31 v51.54,40.31 | v39.85,29.9 40.62,30.66 41.12,30.66 41.63,31.17 41.63,31.97 U1.37
  Bottom 0.254: v51.54,40.31 51.28,40.31 50.27,39.29 45.7,39.29 39.85,33.45 v39.85,29.9
SCL  (via drill 0.41)
  Top 0.254: U5.12 30.46,40.81 v30.71,40.56 | v35.79,36.25 U1.25 | U4.4 30.19,34.97 v30.45,35.23
  Bottom 0.254: v35.79,36.25 32.99,36.25 30.71,38.53 v30.71,40.56 30.45,40.82 26.9,40.82 26.39,40.31 26.39,36.25 27.41,35.23 v30.45,35.23
SDA  (via drill 0.41)
  Top 0.254: v30.45,36.25 28.16,36.25 U4.6 | U1.26 37.07,35.75 36.55,35.23 v35.28,35.23 | U5.11 27.91,40.31 v27.66,40.06
  Bottom 0.254: v27.66,40.06 27.66,36.75 29.95,36.75 v30.45,36.25 31.98,36.25 32.99,35.23 v35.28,35.23
TX0  (via drill 0.41)
  Top 0.254: U1.47 46.66,30.71 46.97,30.4 v46.97,28.88
  Bottom 0.254: v46.97,28.88 46.97,30.4 46.71,30.66 45.19,30.66 45.19,26.67 32.33,26.67 27.66,31.67 23.85,31.67 21.57,33.96 21.57,40.56 JP9.RXI
TX1  (via drill 0.41)
  Top 0.254: v37.31,31.93 37.31,33.96 38.1,34.75 U1.28
  Bottom 0.254: JP1.1 55.35,25.83 54.84,26.34 54.84,28.12 53.32,29.64 52.05,29.64 49.25,32.44 44.09,32.44 44.09,27.66 40.06,27.66 37.31,30.4 v37.31,31.93
VBAT
  Top 0.254: 31.73,21.01 U3.9 | 28.61,20.31 28.68,20.24 | 26.71,20.31 26.64,20.24 | K1.1 58.02,21.14 | 56.62,21.26 56.73,21.14 56.62,21.03
  Top 0.406: 18.52,23.29 JP3.2 16.99,28.37 16.99,48.18 18.77,49.96 18.77,51.49 18.26,51.99 17.62,51.99 K2.1 | 18.52,23.29 C23.1 21.73,20.84 22.33,20.24 26.64,20.24 28.68,20.24 31.73,20.24 | K3.1 17.5,23.04 17.75,23.29 18.52,23.29 | U3.9 31.73,20.24 | U2.3 28.61,20.31 | U2.1 26.71,20.31 | K1.1 56.73,21.14 | 56.62,21.26 56.62,22.78 58.4,24.56 58.4,50.1 K4.1 | 31.73,20.24 56.62,20.24 56.62,21.03

### Text on the board
tPlace: UCSDQuadCop Rev 0 | DTR | RX0 | 3.3V | TX0 | 3.3V | GND | GND | GND | GND | 3.3V | GND | RX1 | VBAT | TX1
tDocu: 0.238 inch / 6.045 mm | 1.76 inch / 44.70 mm | 1.41 inch / 35.81 mm | >Info / Board Name: UCSDQuadCop / Part Number: 0 / Number of Layers: 2 / Board Material Type: FR-4 / Solder Mask Color: Red / Silkscreen Color: White / Finish Plating: HASAL / Revision Number: 0